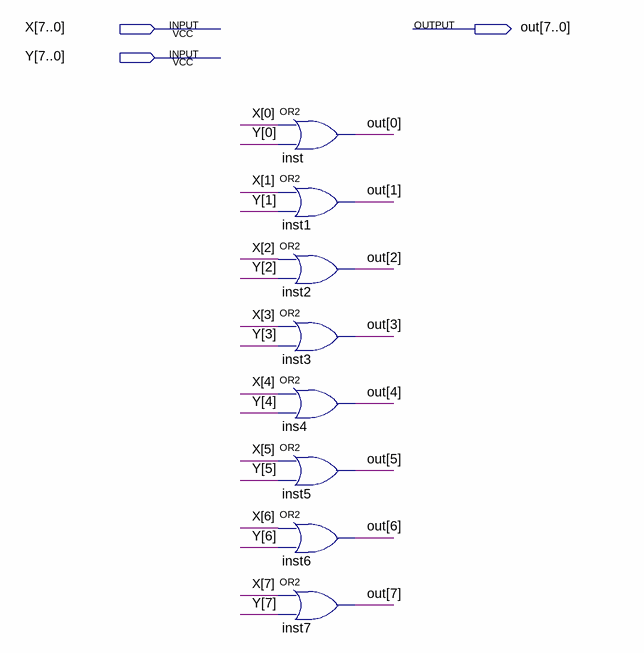
[diagram p0: schematic sheet]
// Quartus schematic OR_op.bdf as structural Verilog: 8 symbols, 3 pins
module OR_op (
  input  [7:0] X,
  input  [7:0] Y,
  output [7:0] out
);

  or inst (out[0], X[0], Y[0]);
  or inst1 (out[1], X[1], Y[1]);
  or inst2 (out[2], X[2], Y[2]);
  or inst3 (out[3], X[3], Y[3]);
  or ins4 (out[4], X[4], Y[4]);
  or inst5 (out[5], X[5], Y[5]);
  or inst6 (out[6], X[6], Y[6]);
  or inst7 (out[7], X[7], Y[7]);
endmodule
